# Altium schematic sheet Arduino_DIY.SchDoc
size 420 x 297 mm; SheetNumber: 1; SheetTotal: 1
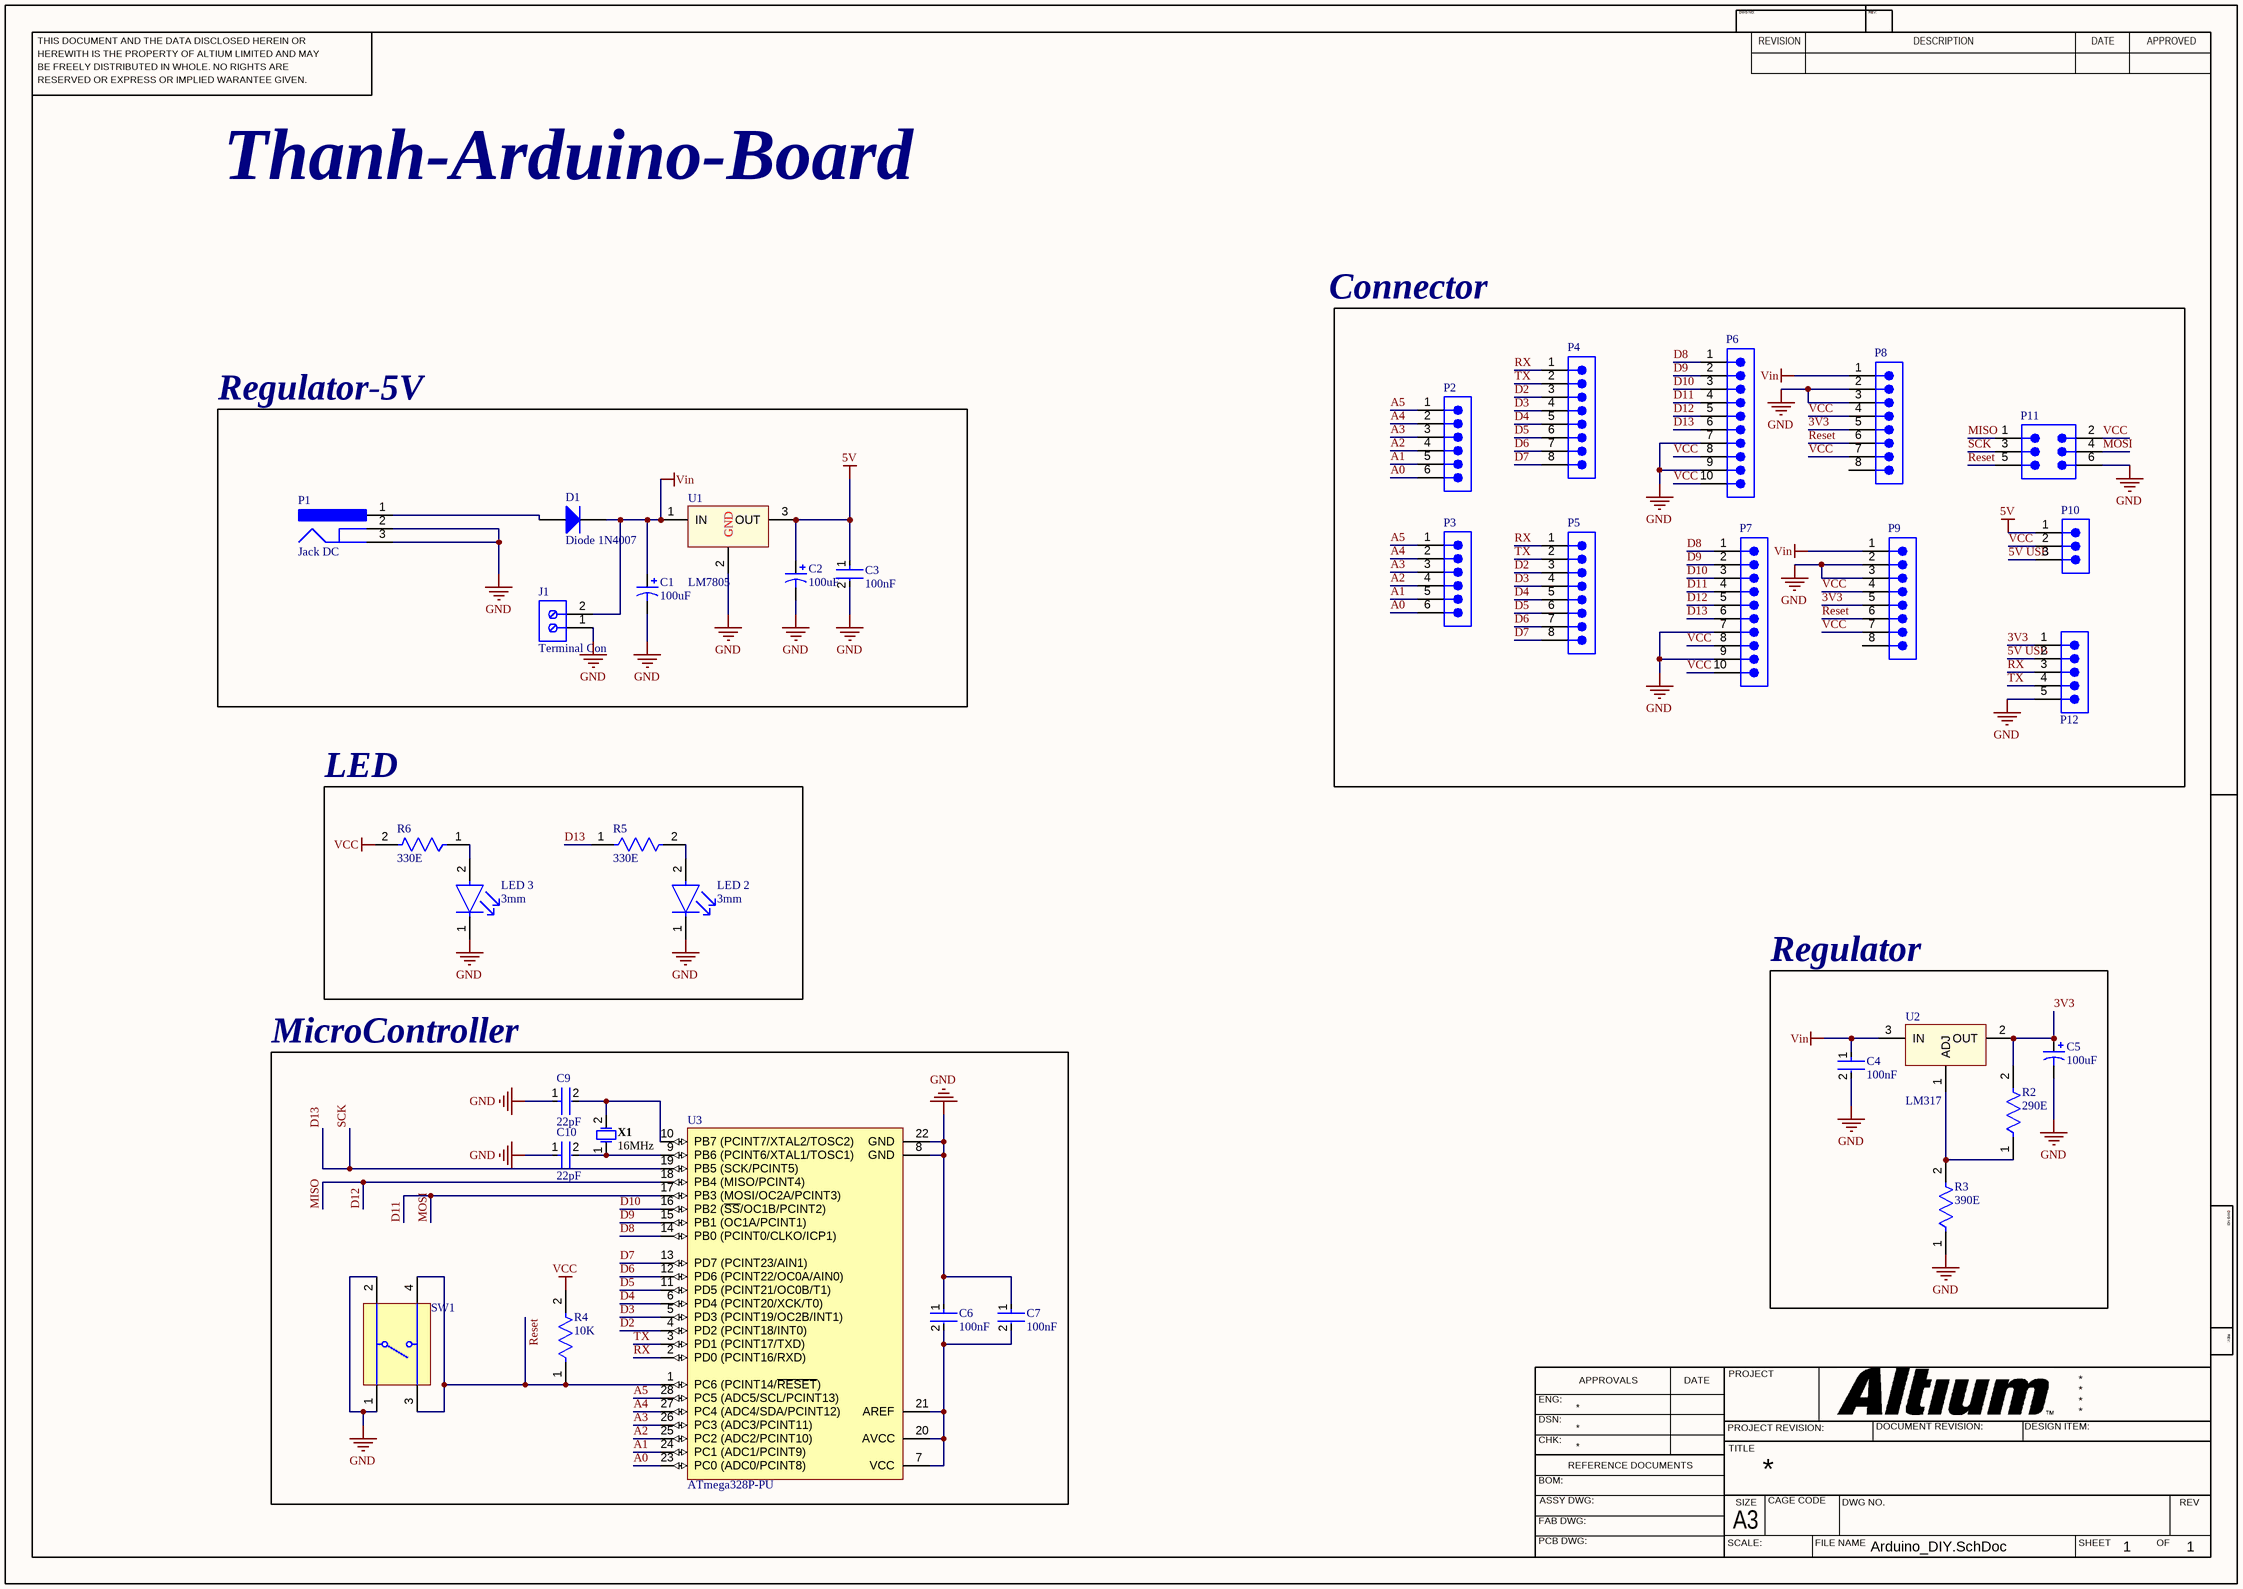
[diagram p0: Arduino_DIY.SchDoc]

## Parts
C1  100uF  [CAP_D6.3]
C2  100uF  [CAP_D6.3]
C3  100nF  [FP-RCE0DB-MFG]
C4  100nF  [FP-RCE0DB-MFG]
C5  100uF  [CAP_D6.3]
C6  100nF  [FP-RCE0DB-MFG]
C7  100nF  [FP-RCE0DB-MFG]
C9  22pF  [FP-RCE0DB-MFG]
C10  22pF  [FP-RCE0DB-MFG]
D1  Diode 1N4007  [DO-41]
J1  Terminal Con  [691214110002]
LED_2  3mm  [FP-HLMP-1503-MFG]
LED_3  3mm  [FP-HLMP-1503-MFG]
P1  Jack DC  [KYCN-KLDX-0202-A_V]
P2  Header 6  [61300611121]  (value not drawn)
P3  Header 6  [61300611121]  (value not drawn)
P4  61300811121  [61300811121]  (value not drawn)
P5  61300811121  [61300811121]  (value not drawn)
P6  Header 10  [61301011121]  (value not drawn)
P7  Header 10  [61301011121]  (value not drawn)
P8  61300811121  [61300811121]  (value not drawn)
P9  61300811121  [61300811121]  (value not drawn)
P10  61300311121  [61300311121]  (value not drawn)
P11  61300621121  [61300621121]  (value not drawn)
P12  61300511121  [61300511121]  (value not drawn)
R2  290E  [FP-MRS25-MFG]
R3  390E  [FP-MRS25-MFG]
R4  10K  [FP-MRS25-MFG]
R5  330E  [FP-MRS25-MFG]
R6  330E  [FP-MRS25-MFG]
SW1  Button  [TECO-1825910-6_V]  (value not drawn)
U1  LM7805  [QTO-220]
U2  LM317  [QTO-220]
U3  ATmega328P-PU  [28P3]
X1  16MHz  [FOX-FOXSLF080-20]

## Blocks framed on the sheet
Regulator-5V: C1-C3 D1 J1 P1 U1
LED: LED_2 LED_3 R5 R6
Regulator: C4 C5 R2 R3 U2
MicroController: C6 C7 C9 C10 R4 SW1 U3 X1

## Nets
5V: C2.1 C3.1 P10.1 U1.3(OUT)
GND: C1.2 C2.2 C3.2 C4.2 C5.2 C6.1 C7.1 C9.1 C10.1 J1.1 LED_2.1(C) LED_3.1(C) P1.2 P1.3 P6.7 P6.9 P7.7 P7.9 P8.2 P8.3 P9.2 P9.3 P11.6 P12.5 R3.1 SW1.1 SW1.2 U1.2(GND) U3.8(GND) U3.22(GND)
VCC: P6.8 P6.10 P7.8 P7.10 P8.4 P8.7 P9.4 P9.7 P10.2 P11.2 R4.2 R6.2
Vin: C1.1 C4.1 D1.2(K) J1.2 P8.1 P9.1 U1.1(IN) U2.3(IN)
3V3: C5.1 P8.5 P9.5 P12.1 R2.2 U2.2(OUT)
5V USB: P10.3 P12.2
A0: P2.6 P3.6 U3.23(PC0_(ADC0/PCINT8))
A1: P2.5 P3.5 U3.24(PC1_(ADC1/PCINT9))
A2: P2.4 P3.4 U3.25(PC2_(ADC2/PCINT10))
A3: P2.3 P3.3 U3.26(PC3_(ADC3/PCINT11))
A4: P2.2 P3.2 U3.27(PC4_(ADC4/SDA/PCINT12))
A5: P2.1 P3.1 U3.28(PC5_(ADC5/SCL/PCINT13))
D2: P4.3 P5.3 U3.4(PD2_(PCINT18/INT0))
D3: P4.4 P5.4 U3.5(PD3_(PCINT19/OC2B/INT1))
D4: P4.5 P5.5 U3.6(PD4_(PCINT20/XCK/T0))
D5: P4.6 P5.6 U3.11(PD5_(PCINT21/OC0B/T1))
D6: P4.7 P5.7 U3.12(PD6_(PCINT22/OC0A/AIN0))
D7: P4.8 P5.8 U3.13(PD7_(PCINT23/AIN1))
D8: P6.1 P7.1 U3.14(PB0_(PCINT0/CLKO/ICP1))
D9: P6.2 P7.2 U3.15(PB1_(OC1A/PCINT1))
D10: P6.3 P7.3 U3.16(PB2_(~{SS}/OC1B/PCINT2))
D11: P6.4 P7.4 P11.4 U3.17(PB3_(MOSI/OC2A/PCINT3))  [also labelled MOSI]
D12: P6.5 P7.5 P11.1 U3.18(PB4_(MISO/PCINT4))  [also labelled MISO]
D13: P6.6 P7.6 P11.3 R5.1 U3.19(PB5_(SCK/PCINT5))  [also labelled SCK]
Reset: P8.6 P9.6 P11.5 R4.1 SW1.3 SW1.4 U3.1(PC6_(PCINT14/~{RESET}))
RX: P4.1 P5.1 P12.3 U3.2(PD0_(PCINT16/RXD))
TX: P4.2 P5.2 P12.4 U3.3(PD1_(PCINT17/TXD))
NetC6_2: C6.2 C7.2 U3.7(VCC) U3.20(AVCC) U3.21(AREF)
NetC9_2: C9.2 U3.10(PB7_(PCINT7/XTAL2/TOSC2)) X1.2
NetC10_2: C10.2 U3.9(PB6_(PCINT6/XTAL1/TOSC1)) X1.1
NetD1_1: D1.1(A) P1.1
NetLED_2_2: LED_2.2(A) R5.2
NetLED_3_2: LED_3.2(A) R6.1
NetR2_1: R2.1 R3.2 U2.1(ADJ)

Not connected (* = marked no-connect by the designer): P8 8; P9 8

## Notes on the sheet
- Thanh-Arduino-Board
- Connector
- THIS DOCUMENT AND THE DATA DISCLOSED HEREIN OR
- HEREWITH IS THE PROPERTY OF ALTIUM LIMITED AND MAY
- DWG NO:
- REVISION
- REV:
- DESCRIPTION
- DATE
- APPROVED
- BE FREELY DISTRIBUTED IN WHOLE. NO RIGHTS ARE
- RESERVED OR EXPRESS OR IMPLIED WARANTEE GIVEN.
- ENG:
- APPROVALS
- PROJECT
- DSN:
- CHK:
- REFERENCE DOCUMENTS
- PROJECT REVISION:
- TITLE
- DOCUMENT REVISION:
- DESIGN ITEM:
- BOM:
- FAB DWG:
- PCB DWG:
- ASSY DWG:
- SCALE:
- A3
- SIZE
- CAGE CODE
- FILE NAME
- DWG NO.
- SHEET
- OF
- REV

## Library data of the parts
C1 C2 C5 = Cap Pol 6mm: Polarized Capacitor (Axial); Published: 8-Jun-2000; LatestRevisionDate: 17-Jul-2002; LatestRevisionNote: Re-released for DXP Platform.; PackageReference: POLAR0.8; Publisher: Altium Limited
C3 C4 C6 C7 C9 C10 = CMP-06035-020630-1: Cap Ceramic 220pF 50V C0G ±5% Radial 2.5mm +125°C Ammo Pack; Lead Diameter: 0.5mm; Lead/Base Style: Straight; Mount: Through Hole; Packaging: Tape and Reel; Lead Pitch: 0.098inch; Capacitance: 220pF; Case/Package: Radial; Diameter: 3.6mm; Package Quantity: 2000; Ratings: AEC-Q200; Termination: Radial; Length: 3.6mm; Voltage Rating (DC): 50V; Height: 3.5mm; Depth: 3.5mm; Voltage Rating: 50V; Dielectric: C0G; Min Operating Temperature: -55°C; Tolerance: 5%; Height - Seated (Max): 0.138inch; Resistor Type: Ceramic; Voltage: 50V; Max Operating Temperature: 125°C; Width: 0.098inch
D1 = Diode 1N4007: 1 Amp General Purpose Rectifier; Published: 8-Jun-2000; LatestRevisionDate: 17-Jul-2002; LatestRevisionNote: Re-released for DXP Platform.; DatasheetVersion: 1998; PackageVersion: Aug-1999; PackageReference: DO-41; Publisher: Altium Limited; PackageDescription: Diode, Axial; Body 5.2 x 2.7 mm (LxDia. max), Lead Dia. 0.86 mm (max); Code_JEDEC: DO-204-AL; ComponentLink1Description: Manufacturer Link; ComponentLink1URL: http://www.fairchildsemi.com/; ComponentLink2Description: Datasheet; ComponentLink2URL: http://www.fairchildsemi.com/ds/1N%2F1N4001.pdf
J1 = CMP-1502-02464-2: NexarPartId: 18818288; Plating: Brass, Steel; Current: 10A; Pitch: 3.5052mm; Number of Levels: 1; Number of Contacts: 2; Wire Gauge (Min): 16AWG; Voltage: 300V; Wire Gauge (Max): 24AWG; Stripping Length: -6mm; Number of Pins: 2; Number of Rows: 1; REACH SVHC: Unknown; RoHS: Compliant; Housing Material: Nylon; Termination: Screw; Mount: Through Hole; Contact Plating: Brass, Tin; Number of Positions Per Level: 2; Color: Blue, Green; Width: 7.9mm; Voltage Rating: 300V; Length: 7.4mm; Current Rating: 10A; Wire/Cable Gauge: 24AWG; Packaging: Box; Max Operating Temperature: 105°C; Lead Pitch: 3.5mm; Height: 8.7mm; Contact Material: Brass; Min Operating Temperature: -40°C
LED_2 LED_3 = CMP-18399-000010-1: LED GREEN DIFFUSED T-1 T/H; Manufacturer: Broadcom; Reverse Voltage: 5V; Wavelength: 569nm; Forward Voltage: 2.1V; Led Orientation: Straight; Viewing Angle: 60°; Max Junction Temp: +110°C; Peak Emmision Wavelength: 565nm; Luminous Intensity: 1mcd; Standoff Height: 0.88mm; Forward Current: 10mA; Mouser Description: LED; Green; 1mcd; 0.115In.Dia.; T-1; 565nm; 25mA; 2.1V; 5V; GaP; -20degC; 100deg; ComponentLink2Description: Datasheet; Digikey Description: LED GREEN DIFFUSED T-1 T/H; Device Class L1: Optoelectronics; Device Class L3: unset; Automotive: No; Device Class L2: LEDs; Manufacturer Part Number: HLMP-1503; Category: Diode; Temperature Range Low: -20°C; Height: 6.35mm; RoHS: TRUE; Octopart: https://octopart.com/hlmp-1503-broadcom-71130371; Temperature: -20°C to +100°C; Lead Free: Yes; ComponentLink2URL: https://docs.broadcom.com/docs/AV02-1555EN; Package: HLMP-1503; Colour: Green; Temperature Range High: +100°C
P1 = CMP-1673-00001-5: DC Power Jack, 24 V, 3.5 A, -25 to 85 degC, 3-Pin THD, RoHS; Manufacturer: Kycon; Voltage Rating: 24 V; Current Rating: 3.5 A; Height: 10.8 mm; Length: 9.2 mm; Pins: 2; Housing Material: PBT; Connector Type: Power; ComponentLink2URL: http://www.kycon.com/Pub_Eng_Draw/KLDX-0202-X.PDF; PackageDescription: 3-Pin Through Hole Device, Body 14.5 x 9 mm; Max Operating Temperature: 85 degC; Min Operating Temperature: -25 degC; PackageReference: KLDX-0202-A; Contact Gender: Female; Package Quantity: 500; Mount: Through Hole; Colour: Black; Contact Plating: Tin; DatasheetVersion: Rev. D3, 06/2013; ComponentLink2Description: Datasheet; RoHSCompliant: true; Mounting Technology: Through Hole; ComponentLink1Description: Manufacturer URL; Contact Material: Brass; ComponentLink1URL: http://www.kycon.com/
P2 P3 = CMP-1502-01070-3: NexarPartId: 20084590; Current Rating: 3A; Pitch: 2.54mm; Gender: Male; Operating Supply Voltage: 250V; Connector Type: Male Pin; Number of Positions: 6; Contact Resistance: 20mΩ; Packaging: Bulk; Number of Pins: 6; Number of Rows: 1; Contact Plating: Gold; Lead Free: Lead Free; RoHS: Compliant; Contact Mating Length: 5.9944mm; Voltage Rating: 250V; REACH SVHC: Unknown; Contact Gender: Male; Housing Material: PBT; Min Operating Temperature: -40°C; Lead Pitch: 2.54mm; Mount: Through Hole; Number of Contacts: 6; Max Operating Temperature: 105°C; Contact Material: Copper; Orientation: Vertical; Termination: Through Hole; Color: Black; Height: 8.89mm
P4 P5 P8 P9 = CMP-1502-01076-3: NexarPartId: 32855533; Connector Type: Male Pin; Number of Contacts: 8; Voltage Rating: 250V; Current Rating: 3A; Contact Resistance: 20mΩ; Pitch: 2.54mm; Gender: Male; Termination: Solder; Contact Material: Copper; Mount: Through Hole; Lead Pitch: 2.54mm; Number of Positions: 8; Operating Supply Voltage: 250V; Number of Pins: 8; Max Operating Temperature: 105°C; Height: 8.54mm; REACH SVHC: Unknown; Number of Rows: 1; Packaging: Bulk; Contact Plating: Gold; Contact Mating Length: 5.9944mm; Orientation: Vertical; RoHS: Compliant; Color: Black; Min Operating Temperature: -40°C
P6 P7 = CMP-1502-01082-5: NexarPartId: 18818159; Gender: Male; Number of Positions: 10; Operating Supply Voltage: 250V; Current Rating: 3A; Contact Resistance: 20mΩ; Connector Type: Male Pin; Insulation Resistance: 1GΩ; Pitch: 2.54mm; Color: Black; Contact Gender: Male; Height: 8.74mm; Orientation: Vertical; RoHS: Compliant; Packaging: Bulk; Min Operating Temperature: -40°C; Number of Pins: 10; Max Operating Temperature: 105°C; REACH SVHC: Unknown; Voltage Rating: 250V; Number of Rows: 1; Housing Material: PBT; Number of Contacts: 10; Mount: Through Hole; Contact Mating Length: 5.9944mm; Length: 2.54mm; Lead Pitch: 2.54mm; Flammability Rating: UL94 V-0; Termination: Solder; Contact Material: Copper; Width: 25.4mm; Contact Plating: Gold
P10 = CMP-1502-01062-3: NexarPartId: 32855521; Current Rating: 3A; Voltage Rating: 250V; Number of Positions: 3; Pitch: 2.54mm; Contact Resistance: 20mΩ; Connector Type: Male Pin; Gender: Male; REACH SVHC: Unknown; Packaging: Bulk; Contact Material: Copper; Min Operating Temperature: -40°C; Number of Rows: 1; Orientation: Vertical; RoHS: Compliant; Contact Plating: Gold; Max Operating Temperature: 105°C; Mount: Through Hole; Height: 8.94mm; Operating Supply Voltage: 250V; Number of Pins: 3; Contact Mating Length: 5.9944mm; Number of Contacts: 3; Color: Black; Lead Free: Lead Free; Lead Pitch: 2.54mm; Termination: Solder
P11 = CMP-1502-01072-3: NexarPartId: 32855529; Row Spacing: 2.54mm; Current Rating: 3A; Voltage Rating: 250V; Contact Resistance: 20mΩ; Connector Type: Male Pin; Number of Positions: 6; Gender: Male; Termination: Solder; Orientation: Vertical; Max Operating Temperature: 105°C; Contact Plating: Gold; Height: 8.89mm; Contact Mating Length: 5.9944mm; Mount: Through Hole; Min Operating Temperature: -40°C; Lead Pitch: 2.54mm; Number of Pins: 6; Operating Supply Voltage: 250V; Color: Black; Pitch: 2.54mm; Packaging: Bulk; Contact Material: Copper; REACH SVHC: Unknown; RoHS: Compliant; Number of Rows: 2; Number of Contacts: 6
P12 = CMP-1502-01068-3: NexarPartId: 32855526; Connector Type: Male Pin; Gender: Male; Contact Resistance: 20mΩ; Pitch: 2.54mm; Operating Supply Voltage: 250V; Current Rating: 3A; Number of Contacts: 5; Lead Free: Lead Free; Color: Black; Packaging: Bulk; Lead Pitch: 2.54mm; Contact Material: Copper; Min Operating Temperature: -40°C; Contact Mating Length: 5.9944mm; Voltage Rating: 250V; Number of Pins: 5; Number of Positions: 5; Height: 8.89mm; Orientation: Vertical; REACH SVHC: Unknown; RoHS: Compliant; Contact Plating: Gold; Max Operating Temperature: 105°C; Mount: Through Hole; Number of Rows: 1; Termination: Solder
R2-R6 = CMP-02408-000051-1: RES 1K OHM 0.6W 1% AXIAL; Power Rating: 600mW; Lead Diameter: 0.6mm; Voltage Rating (DC): 350V; Resistance: 1kR; Temperature Coefficient: 50ppm/°C; Width: 2.5mm; Military Standard: Not; Package Quantity: 5000; Radiation Hardening: No; Case/Package: Axial; Resistance Tolerance: 1%; Resistor Type: Metal Film; Contact Plating: Tin; Length: 6.5mm; Lead Free: Lead Free; RoHS Compliant: Yes; Mount: Through Hole; Number of Pins: 2; Technology: THIN FILM; Voltage Rating: 350V; Min Operating Temperature: -55°C; Weight: 0.00776oz; Diameter: 2.5mm; Construction: Cylindrical; Series: MRS25; Tolerance: 1%; Packaging: Tape and Reel; Max Operating Temperature: 155°C; Max Power Dissipation: 600mW; Number of Terminations: 2; Termination: Axial
SW1 = CMP-1684-00021-1: Tact Switch, SPST-NO, 0.05 A, -35 to 85 degC, 4-Pin THD, RoHS, Bulk; Part No: 1825910-6; Manufacturer: TE Connectivity; Maximum Contact Resistance: 100mOhm; Mechanical Life: 100000Cycles; Bushing Type: Unthreaded; Switch Configuration: OFF(ON); Maximum DC Voltage Rating: 24V; Contact Rating @ Voltage: 0.05A@24VDC; Actuator Color: Black; Body Orientation: Straight; Function: MomentaryContact; Illumination: N/R; Actuator Style: RoundButton; Actuator Material: PolybutyleneTerephthalate; Dielectric Strength: 500VAC; Pole Throw Configuration: SPST; Actuator Length: 1.4mm; Product Weight: N/A; Contact Material: CopperAlloy; Housing Material: N/A; Terminal Type: PCPins; Minimum Insulation Resistance: 100MOhm; Package Description: 4-Pin Through Hole Device, Body 5.99 x 5.99 mm, Pitch 6.5 mm; Package Reference: THD; Base Material: N/A; Manufacturer URL: http://www.te.com; Contact Plating: Silver; RoHS: Yes; Datasheet Version: Rev. C9; Electrical Life: 100000Cycles; Maximum AC Voltage Rating: N/A; Thread Size: N/R; Operating Temperature: -35to85C; Mounting: ThroughHole; Dimension: 5.99x5mm; Datasheet URL: http://www.te.com/commerce/DocumentDelivery/DDEController?Action=showdoc&DocId=Customer+Drawing%7F1825910%7FC9%7Fpdf%7FEnglish%7FENG_CD_1825910_C9.pdf%7F1825910-6; Family: 1825910; Seal Location: N/A; Seal Description: N/A; Packaging: N/A
U1 = LM78xx: On ap +, from + 5 to + 24VDC; Value: LM7805
U2 = LM317: Adj Voltage +1.2 -> +37V; Value: LM317
U3 = CMP-0095-00013-2: 8-bit AVR Microcontroller, 32KB Flash, 1KB EEPROM, 2KB SRAM, 28-pin PDIP, Industrial Grade (-40°C to 85°C); RevisionNote: DatasheetVersion updated. URLs added.; PackageVersion: revB, Sep-2001; PackageDescription: 28-lead (0.300"/7.62mm Wide) Plastic Dual Inline Package (PDIP); DatasheetVersion: revD, May-2011; ComponentLink1Description: Manufacturer URL; ComponentLink1URL: http://www.atmel.com/; PackageReference: 28P3; ComponentLink2Description: ATmega48A/48PA/88A/88PA/168A/168PA/328/328P Datasheet; ComponentLink3URL: http://www.atmel.com/dyn/resources/prod_documents/8271S.pdf; ComponentLink2URL: http://www.atmel.com/dyn/resources/prod_documents/8271.pdf; ComponentLink3Description: ATmega48A/48PA/88A/88PA/168A/168PA/328/328P Summary
X1 = CMP-1749-00002-1: Resistance Weld Thru-Hole Crystal, 8 MHz, -20 to 70 degC, 2-Pin THD, RoHS, Bulk; Dropout Voltage: 2 V; Outputs: 1; Nominal Output Voltage: 5 V; Min Input Voltage: 7 V; Case\Package: TO-263-3; Max Input Voltage: 35 V; Max Ouput Current: 1 A; Length: 10.24 mm; Max Operating Temperature: 125 degC; Mount: Surface Mount; PackageDescription: 2-Pin Through Hole Device, Body 11.35 x 4.65 mm; Package Quantity: 50; Pins: 3; ComponentLink2URL: http://download.siliconexpert.com/pdfs/2015/4/5/6/5/7/200/fox_/manual/35607121449963728hc49slf.pdf; PackageReference: FOXSLF080-20; Min Operating Temperature: 0 degC; Height: 30.02 mm; Packaging: Rail/Tube; Radiation Hardening: No; Width: 9.35 mm; ComponentLink1URL: http://www.foxonline.com/; DatasheetVersion: Mar-15; ComponentLink1Description: Manufacturer URL; Output Voltage: 5 V; RoHSCompliant: true; REACH SVHC: No SVHC; Output Current: 1 A; ComponentLink2Description: Datasheet